# Altium schematic sheet SDCard.SchDoc
size A4
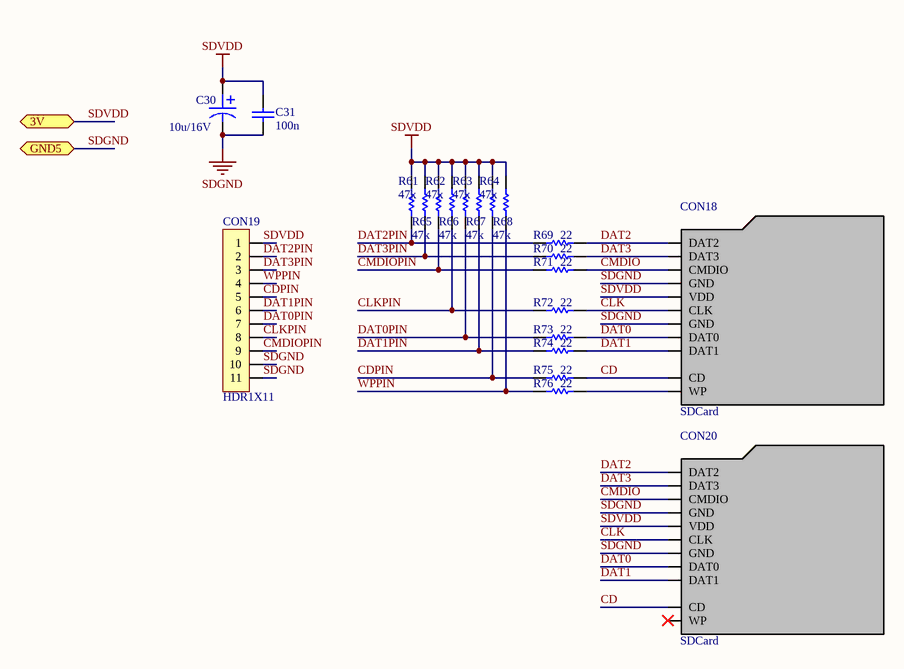
[diagram p0: SDCard.SchDoc]

## Parts
C30  10u/16V  [CA]
C31  100n  [0805C]
CON18  SDCard  [SDCard]
CON19  HDR1X11  [HDR1X11RAST]
CON20  SDCard  [MICROSDCARD]
R61  47k  [0805R]
R62  47k  [0805R]
R63  47k  [0805R]
R64  47k  [0805R]
R65  47k  [0805R]
R66  47k  [0805R]
R67  47k  [0805R]
R68  47k  [0805R]
R69  22  [0805R]
R70  22  [0805R]
R71  22  [0805R]
R72  22  [0805R]
R73  22  [0805R]
R74  22  [0805R]
R75  22  [0805R]
R76  22  [0805R]

## Ports
3V, GND5

## Nets
SDGND: C30.2 C31.1 CON18.GND CON19.10 CON19.11 CON20.GND ; port GND5
SDVDD: C30.1 C31.2 CON18.VDD CON19.1 CON20.VDD R61.2 R62.2 R63.2 R64.2 R65.2 R66.2 R67.2 R68.2 ; port 3V
CD: CON18.CD CON20.CD R75.2
CDPIN: CON19.5 R64.1 R75.1
CLK: CON18.CLK CON20.CLK R72.2
CLKPIN: CON19.8 R66.1 R72.1
CMDIO: CON18.CMDIO CON20.CMDIO R71.2
CMDIOPIN: CON19.9 R62.1 R71.1
DAT0: CON18.DAT0 CON20.DAT0 R73.2
DAT0PIN: CON19.7 R63.1 R73.1
DAT1: CON18.DAT1 CON20.DAT1 R74.2
DAT1PIN: CON19.6 R67.1 R74.1
DAT2: CON18.DAT2 CON20.DAT2 R69.2
DAT2PIN: CON19.2 R61.1 R69.1
DAT3: CON18.DAT3 CON20.DAT3 R70.2
DAT3PIN: CON19.3 R65.1 R70.1
WPPIN: CON19.4 R68.1 R76.1
NetCON18_WP: CON18.WP R76.2

Not connected (* = marked no-connect by the designer): CON20 WP*

## Library data of the parts
C30 = ELECTROLYTIC_CAPACITOR: Value: 10u/16V
C31 = CAPACITOR: Value: 100n
CON20 = SDCard: pin to pad: WP>none
R61-R76 = RESISTOR
  R61-R68: Value: 47k
  R69-R76: Value: 22